# EasyEDA schematic SCH_Remote Recovery Switch Mini v1_2025-12-06.json
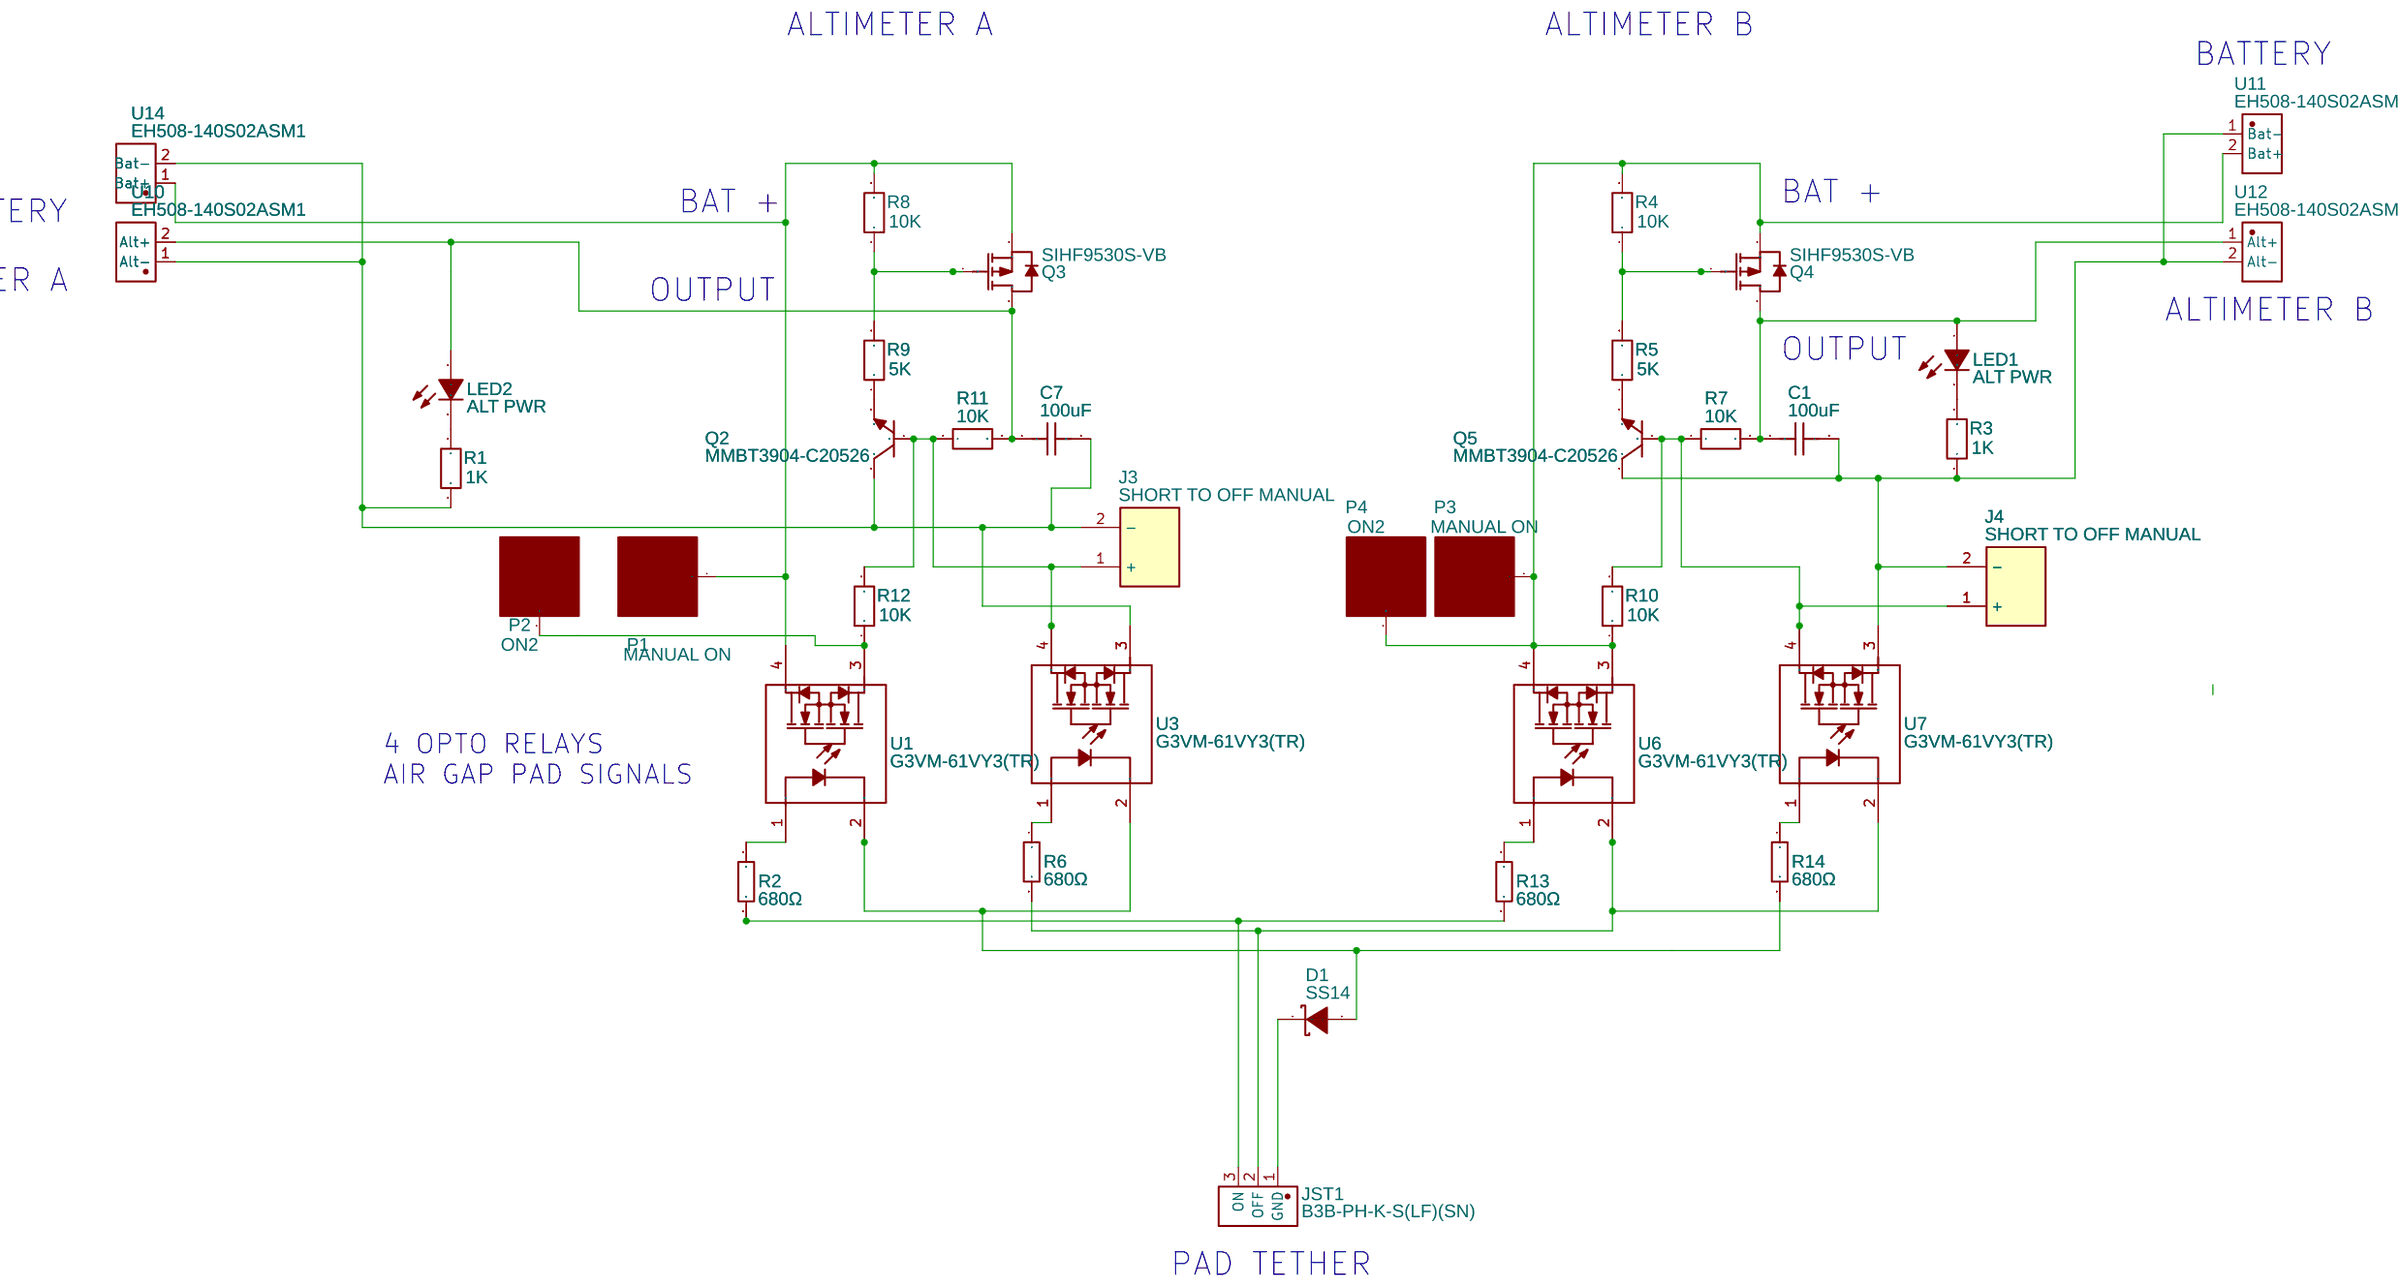
[diagram p0: schematic sheet]

## Parts
C1  100uF  [C1206]
C7  100uF  [C1206]
D1  SS14  [SMA_L4.2-W2.6-LS5.0-RD_1]
J3  SHORT TO OFF MANUAL  [CONN-TH_B2B-PH-K-S]
J4  SHORT TO OFF MANUAL  [CONN-TH_B2B-PH-K-S]
JST1  B3B-PH-K-S(LF)(SN)  [CONN-TH_B3B-PH-K-S]
LED1  ALT PWR  [LED-SMD_L3.5-W2.8-R-RD]
LED2  ALT PWR  [LED-SMD_L3.5-W2.8-R-RD]
P1  MANUAL ON  [PAD_1.5X2.5]
P2  ON2  [PAD_1.5X2.5]
P3  MANUAL ON  [PAD_1.5X2.5]
P4  ON2  [PAD_1.5X2.5]
Q2  MMBT3904-C20526  [SOT-23-3_L2.9-W1.3-P1.90-LS2.4-BR]
Q3  SIHF9530S-VB  [TO-263-2_L10.5-W9.1-P5.08-LS15.2-BR]
Q4  SIHF9530S-VB  [TO-263-2_L10.5-W9.1-P5.08-LS15.2-BR]
Q5  MMBT3904-C20526  [SOT-23-3_L2.9-W1.3-P1.90-LS2.4-BR]
R1  1K  [R0603]
R2  680Ω  [R0603]
R3  1K  [R0603]
R4  10K  [R0603]
R5  5K  [R0603]
R6  680Ω  [R0603]
R7  10K  [R0603]
R8  10K  [R0603]
R9  5K  [R0603]
R10  10K  [R0603]
R11  10K  [R0603]
R12  10K  [R0603]
R13  680Ω  [R0603]
R14  680Ω  [R0603]
U1  G3VM-61VY3(TR)  [SOP-4_L3.9-W4.4-P2.54-LS7.0-BR]
U3  G3VM-61VY3(TR)  [SOP-4_L3.9-W4.4-P2.54-LS7.0-BR]
U6  G3VM-61VY3(TR)  [SOP-4_L3.9-W4.4-P2.54-LS7.0-BR]
U7  G3VM-61VY3(TR)  [SOP-4_L3.9-W4.4-P2.54-LS7.0-BR]
U10  EH508-140S02ASM1  [CONN-TH_EH508-140S02ASM1_MB]
U11  EH508-140S02ASM1  [CONN-TH_EH508-140S02ASM1_MB]
U12  EH508-140S02ASM1  [CONN-TH_EH508-140S02ASM1_MB]
U14  EH508-140S02ASM1  [CONN-TH_EH508-140S02ASM1_MB]

## Library data of the parts
C1 C7 = GRM31CR61A107MEA8L: Supplier: LCSC; Supplier Part: C883598; Manufacturer: muRata(村田); Contributor: lcsc; JLCPCB Part Class: Extended Part
D1 = SS14: Supplier: LCSC; Manufacturer: MDD(辰达半导体); Supplier Part: C2480; JLCPCB Part Class: Basic Part; link: https://lcsc.com/eda_search?q=C2480&%26type=1&ref=editor
J3 J4 = B2B-PH-K-S(LF)(SN): Supplier: LCSC; Manufacturer: JST; Contributor: LCSC; Supplier Part: C131337
JST1 = B3B-PH-K-S(LF)(SN): Contributor: LCSC; Supplier: LCSC; Manufacturer: JST; Supplier Part: C131339; JLCPCB Part Class: Extended Part; link: https://lcsc.com/eda_search?q=C131339&%26type=1&ref=editor
LED1 LED2 = 67-21/R6C-FN2Q1BZ/2T: Supplier: LCSC; Manufacturer: EVERLIGHT; image: //image.lceda.cn/szlcsc/C74350.jpg; Supplier Part: C74350; SMT Type: Extend; JLCPCB SMD: Yes; LCSC Assembly: Yes; Paste Type: expand
P1-P4 = Solder Pad: Manufacturer Part: Soldering pad; Supplier Part: undefined; Contributor: Michael Gronlund
Q2 Q5 = MMBT3904-C20526: Contributor: 立创EDA官方封装库; Supplier: LCSC; Manufacturer: CJ(江苏长电/长晶); Manufacturer Part: MMBT3904(RANGE:100-300); Supplier Part: C20526; JLCPCB Part Class: Basic Part; link: https://lcsc.com/eda_search?q=C20526&%26type=1&ref=editor
Q3 Q4 = SIHF9530S-VB: Contributor: lcsc; Supplier: LCSC; Supplier Part: C5179543; Manufacturer: VBsemi(微碧半导体); Manufacturer Part: SiHF9530S-VB; JLCPCB Part Class: Extended Part; link: https://lcsc.com/eda_search?q=C5179543&%26type=1&ref=editor
R1 R3-R5 R7-R12 = SFR03EZPF1001: Supplier: LCSC; Supplier Part: C2941038; Manufacturer: ROHM(罗姆); Contributor: lcsc
R2 R6 R13 R14 = 0603WAF6800T5E: Supplier: LCSC; Manufacturer: UNI-ROYAL(厚声); Supplier Part: C23228; JLCPCB Part Class: Basic Part; link: https://lcsc.com/eda_search?q=C23228&%26type=1&ref=editor
U1 U3 U6 U7 = G3VM-61VY3(TR): Supplier: LCSC; Supplier Part: C2152318; Manufacturer: OMRON(欧姆龙); Contributor: LCSC; JLCPCB Part Class: Extended Part
U10-U12 U14 = EH508-140S02ASM1: Contributor: LCSC; Supplier: LCSC; Supplier Part: C843210; Manufacturer: Wcon(维峰电子); JLCPCB Part Class: Extended Part; link: https://lcsc.com/eda_search?q=C843210&%26type=1&ref=editor

## Nets
Net-(C1-1): C1.1 LED1.1(A) Q4.2(D) R7.2 U12.1(Alt+)
Net-(C1-2): C1.2 J4.2(-) Q5.3(C) R3.1 U7.3 U11.1(Bat-) U12.2(Alt-)
Net-(C7-1): C7.1 LED2.1(A) Q3.2(D) R11.2 U10.2(Alt+)
Net-(C7-2): C7.2 J3.2(-) Q2.3(C) R1.1 U3.3 U10.1(Alt-) U14.2(Bat-)
Net-(D1-1): D1.1(K) JST1.1(GND)
Net-(D1-2): D1.2(A) R14.2 U1.2 U3.2
Net-(J3-1): J3.1(+) Q2.1(B) R11.1 R12.2 U3.4
Net-(J4-1): J4.1(+) Q5.1(B) R7.1 R10.2 U7.4
Net-(JST1-2): JST1.2(OFF) R6.2 U6.2 U7.2
Net-(JST1-3): JST1.3(ON) R2.2 R13.2
Net-(LED1-2): LED1.2(C) R3.2
Net-(LED2-2): LED2.2(C) R1.2
Net-(P1-1): P1.1 Q3.3(S) R8.2 U1.4 U14.1(Bat+)
Net-(P2-1): P2.1 R12.1 U1.3
Net-(P3-1): P3.1 P4.1 Q4.3(S) R4.2 R10.1 U6.3 U6.4 U11.2(Bat+)
Net-(Q2-2): Q2.2(E) R9.1
Net-(Q3-1): Q3.1(G) R8.1 R9.2
Net-(Q4-1): Q4.1(G) R4.1 R5.2
Net-(Q5-2): Q5.2(E) R5.1
Net-(R2-1): R2.1 U1.1
Net-(R6-1): R6.1 U3.1
Net-(R13-1): R13.1 U6.1
Net-(R14-1): R14.1 U7.1

## Notes on the sheet
- ALTIMETER A
- ALTIMETER B
- BATTERY
- BAT +
- BAT +
- BATTERY
- ALTIMETER A
- OUTPUT
- ALTIMETER B
- OUTPUT
- 4 OPTO RELAYS
  AIR GAP PAD SIGNALS
- PAD TETHER
